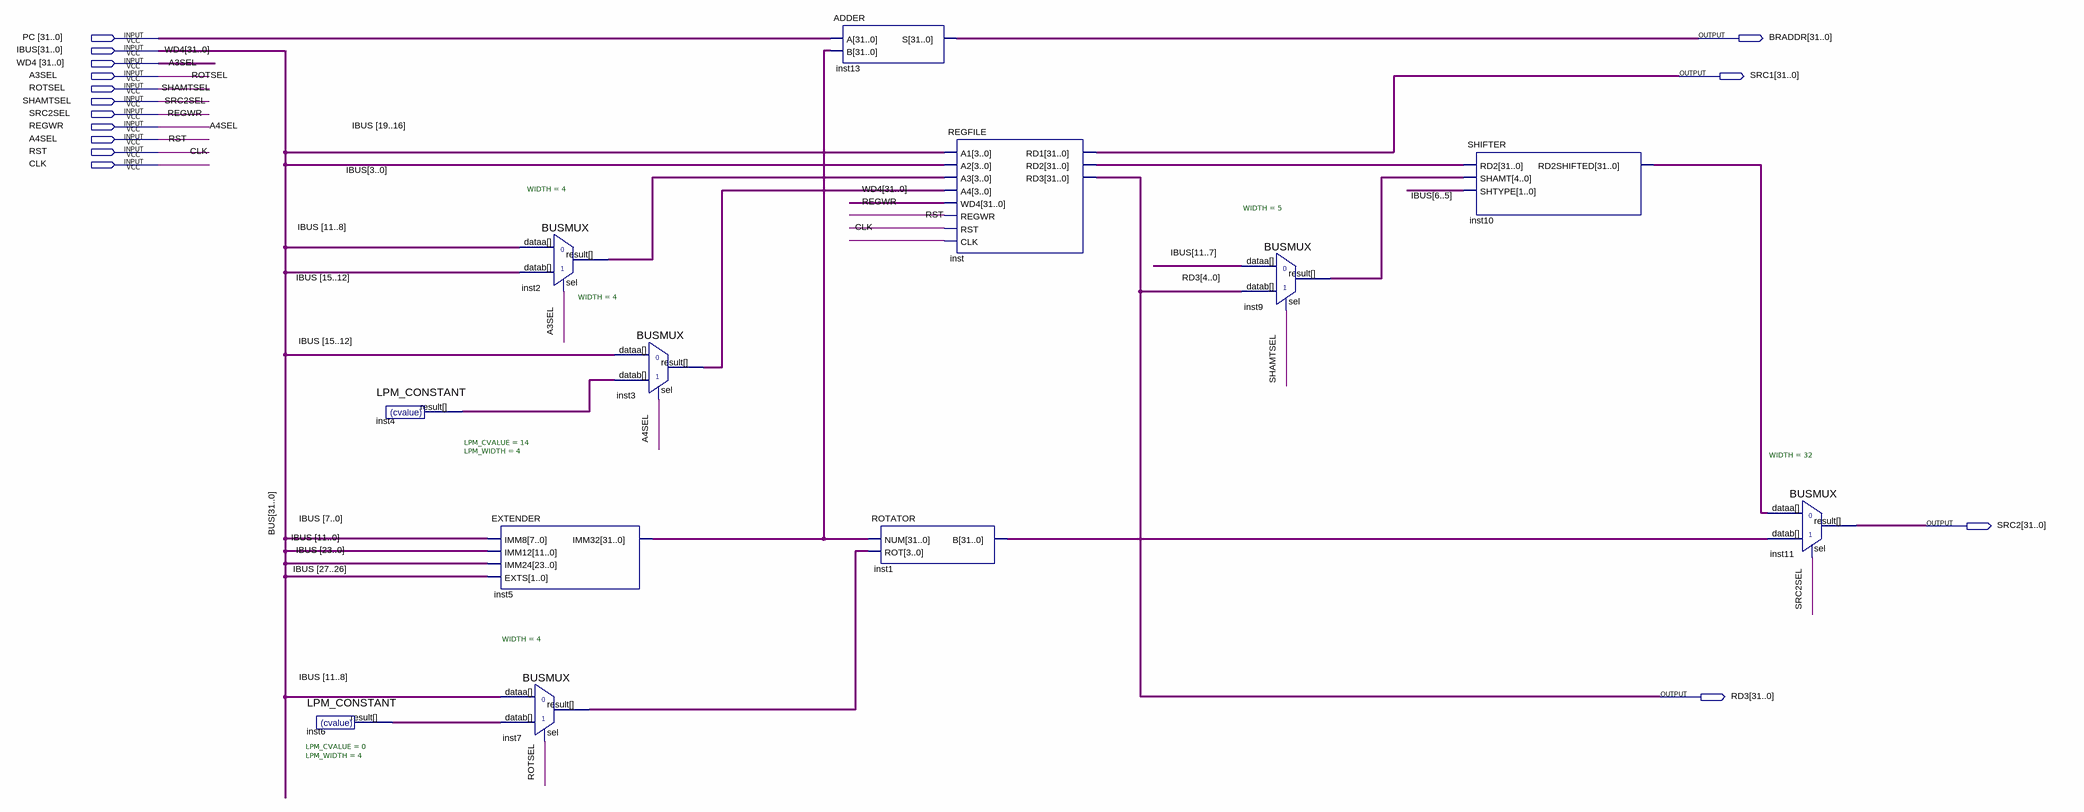
[diagram p0: schematic sheet]
// Quartus schematic DECODE.bdf as structural Verilog: 12 symbols, 15 pins
module DECODE (
  input  [31:0] PC,
  input  [31:0] IBUS,
  input  [31:0] WD4,
  input  A3SEL,
  input  ROTSEL,
  input  SHAMTSEL,
  input  SRC2SEL,
  input  REGWR,
  input  A4SEL,
  input  RST,
  input  CLK,
  output [31:0] BRADDR,
  output [31:0] SRC1,
  output [31:0] SRC2,
  output [31:0] RD3
);

  wire [3:0] inst2_result, inst3_result, inst4_result, inst6_result, inst7_result;
  wire [4:0] inst9_result;
  wire [31:0] inst1_b, inst5_imm32, inst10_rd2shifted, inst_rd2;

  LPM_CONSTANT #(.LPM_CVALUE(0), .LPM_WIDTH(4)) inst6 (.result(inst6_result));
  LPM_CONSTANT #(.LPM_CVALUE(14), .LPM_WIDTH(4)) inst4 (.result(inst4_result));
  EXTENDER inst5 (.IMM8(IBUS[7:0]), .IMM12(IBUS[11:0]), .IMM24(IBUS[23:0]), .EXTS(IBUS[27:26]), .IMM32(inst5_imm32));
  BUSMUX #(.WIDTH(4)) inst7 (.datab(inst6_result), .sel(ROTSEL), .dataa(IBUS[11:8]), .result(inst7_result));
  BUSMUX #(.WIDTH(4)) inst2 (.datab(IBUS[15:12]), .sel(A3SEL), .dataa(IBUS[11:8]), .result(inst2_result));
  BUSMUX #(.WIDTH(4)) inst3 (.datab(inst4_result), .sel(A4SEL), .dataa(IBUS[15:12]), .result(inst3_result));
  ADDER inst13 (.A(PC), .B(inst5_imm32), .S(BRADDR));
  ROTATOR inst1 (.NUM(inst5_imm32), .ROT(inst7_result), .B(inst1_b));
  REGFILE inst (
    .A1(IBUS[19:16]), .A2(IBUS[3:0]), .A3(inst2_result), .A4(inst3_result), .WD4(WD4), .REGWR(REGWR),
    .RST(RST), .CLK(CLK), .RD1(SRC1), .RD2(inst_rd2), .RD3(RD3));
  BUSMUX #(.WIDTH(5)) inst9 (.datab(RD3[4:0]), .sel(SHAMTSEL), .dataa(IBUS[11:7]), .result(inst9_result));
  SHIFTER inst10 (.RD2(inst_rd2), .SHAMT(inst9_result), .SHTYPE(IBUS[6:5]), .RD2SHIFTED(inst10_rd2shifted));
  BUSMUX #(.WIDTH(32)) inst11 (.datab(inst1_b), .sel(SRC2SEL), .dataa(inst10_rd2shifted), .result(SRC2));

  // Other names for the same wires on the sheet: BUS[31:0] = IBUS
endmodule
